# EAGLE design Motor Quad Board (EAGLE 8.7.0)
CNAME: Franks FlightSim Boards; CPROJECT: Franks FlightSim Boards; CREVISION: v0.1; DESIGNER: Frank van Ierland
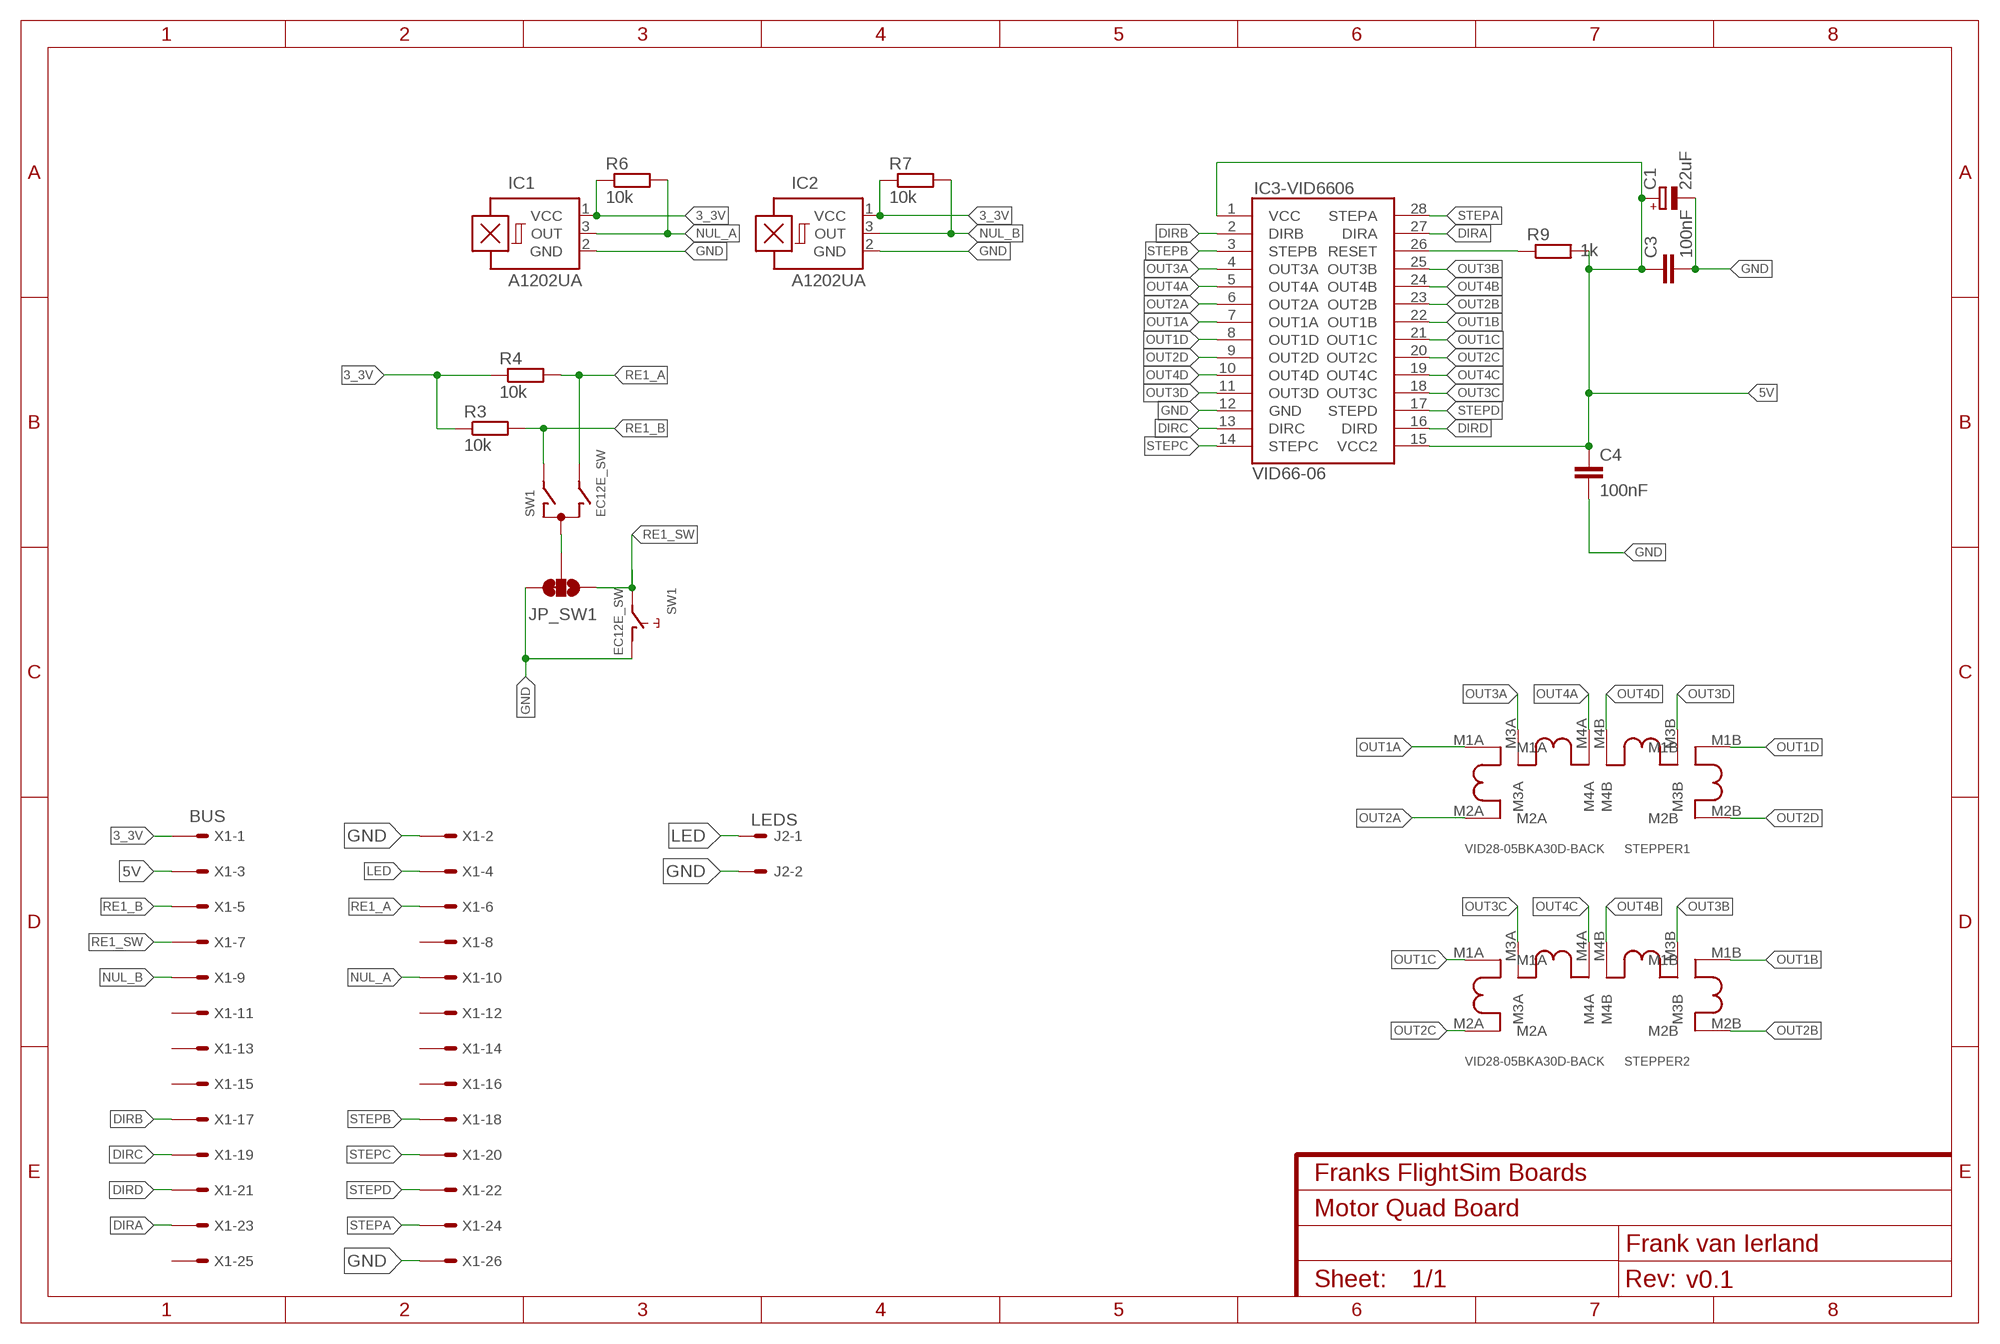
[diagram p0: schematic, sheet 1]

## Parts
C1  22uF  CPOL-EU153CLV-0505  [153CLV-0505]
C3  100nF  C-EUC0805  [C0805]
C4  100nF  C-EUC0805  [C0805]
IC1  A1202UA  [SIP3-UA]
IC2  A1202UA  [SIP3-UA]
IC3-VID6606  VID66-06  [SO28W]
J2  LEDS  22-27-2021-02  [6410-02]
JP_SW1  JUMPER-SMT_3_1-NC_TRACE_SILK  [SMT-JUMPER_3_1-NC_TRACE_SILK]
R3  10k  R-EU_M1206  [M1206]
R4  10k  R-EU_M1206  [M1206]
R6  10k  R-EU_M1206  [M1206]
R7  10k  R-EU_M1206  [M1206]
R9  1k  R-EU_M1206  [M1206]
STEPPER1  VID28-05BKA30D-BACK  [BKA30D-R5-BACKMOUNT]
STEPPER2  VID28-05BKA30D-BACK  [BKA30D-R5-BACKMOUNT]
SW1  EC12E_SW  [ALPS_EC12E_SW]
X1  BUS  057-026-1  [057-026-1]

## Nets
3_3V [3_3V]: IC1.1(VCC) IC2.1(VCC) R3.1 R4.1 R6.1 R7.1 X1.1
5V [5V]: C1.+ C3.1 C4.1 IC3-VID6606.1(VCC) IC3-VID6606.15(VCC2) R9.2 X1.3
DIRA: IC3-VID6606.27(DIRA) X1.23
DIRB: IC3-VID6606.2(DIRB) X1.17
DIRC: IC3-VID6606.13(DIRC) X1.19
DIRD: IC3-VID6606.16(DIRD) X1.21
GND [GND]: C1.- C3.2 C4.2 IC1.2(GND) IC2.2(GND) IC3-VID6606.12(GND) J2.2 JP_SW1.3 SW1.D X1.2 X1.26
LED [LED]: J2.1 X1.4
N$8: JP_SW1.2 SW1.C
N$15: IC3-VID6606.26(RESET) R9.1
NUL_A: IC1.3(OUT) R6.2 X1.10
NUL_B: IC2.3(OUT) R7.2 X1.9
OUT1A: IC3-VID6606.7(OUT1A) STEPPER1.M1A
OUT1B: IC3-VID6606.22(OUT1B) STEPPER2.M1B
OUT1C: IC3-VID6606.21(OUT1C) STEPPER2.M1A
OUT1D: IC3-VID6606.8(OUT1D) STEPPER1.M1B
OUT2A: IC3-VID6606.6(OUT2A) STEPPER1.M2A
OUT2B: IC3-VID6606.23(OUT2B) STEPPER2.M2B
OUT2C: IC3-VID6606.20(OUT2C) STEPPER2.M2A
OUT2D: IC3-VID6606.9(OUT2D) STEPPER1.M2B
OUT3A: IC3-VID6606.4(OUT3A) STEPPER1.M3A
OUT3B: IC3-VID6606.25(OUT3B) STEPPER2.M3B
OUT3C: IC3-VID6606.18(OUT3C) STEPPER2.M3A
OUT3D: IC3-VID6606.11(OUT3D) STEPPER1.M3B
OUT4A: IC3-VID6606.5(OUT4A) STEPPER1.M4A
OUT4B: IC3-VID6606.24(OUT4B) STEPPER2.M4B
OUT4C: IC3-VID6606.19(OUT4C) STEPPER2.M4A
OUT4D: IC3-VID6606.10(OUT4D) STEPPER1.M4B
RE1_A: R4.2 SW1.B X1.6
RE1_B: R3.2 SW1.A X1.5
RE1_SW: JP_SW1.1 SW1.E X1.7
STEPA: IC3-VID6606.28(STEPA) X1.24
STEPB: IC3-VID6606.3(STEPB) X1.18
STEPC: IC3-VID6606.14(STEPC) X1.20
STEPD: IC3-VID6606.17(STEPD) X1.22
Unconnected: SW1.GND1(G) SW1.GND2(G) X1.8 X1.11 X1.12 X1.13 X1.14 X1.15 X1.16 X1.25

## Library data of the parts
C1 = resistor:CPOL-EU: POLARIZED CAPACITOR, European symbol
C3 C4 = rcl:C-EU: CAPACITOR, European symbol; SPICEPREFIX: C
IC1 IC2 = allegro:A12*?: Hall-effect bipolar switch Source: http://www.allegromicro.com/en/Products/Part_Numbers/1202/1202.pdf; OC_FARNELL: unknown; OC_NEWARK: unknown
IC3-VID6606 = Franks:VID66-06: GENERAL DESCRIPTION The quad stepping motor driver VID66-06 is a monolithic CMOS device intended to be used as an interface circuit to ease the use of the stepper motor VID29-XX. It is specifically designed for applications in the car dashboard. The chip allows the user to drive four motors as it contains four identical drivers on the same chip. The driver circuit converts a pulse train f(scx) into a current level sequence sent to the motor coils. This sequence is used to produce the micro stepping movement of the motor. Each inner driver in the chip generates 2 sequent logic pulse signals and provides shaft stepping angle resolution 1/12°. FEATURES -Generates micro steps -Glitch filters on all inputs -VDD = 4.5 to 5.5V -Low EMI emission Link to pdf <http://www.vid.wellgain.com/UploadFile/down/2009111391612_VID6606%20manual%20060927.pdf>
J2 = con-molex:22-?-02: CONNECTOR wire to board 2.54 mm (.1 inch) pitch header; MF: MOLEX; OC_FARNELL: unknown; OC_NEWARK: unknown
JP_SW1 = SparkFun-Jumpers:JUMPER-SMT_3_1-NC_TRACE: Normally closed trace jumper (1 of 2 connections) This jumper has a trace between two pads so it's normally closed (NC). The other connection is normally open (NO). Use a razor knife to open the connection. For best results follow the IPC guidelines for cutting traces: Cutout at least 0.063 mm (0.005 in). Remove all loose material to clean up the cut area. Seal the cut with an approved epoxy. Reapply solder to reclose the connection, or to close the NO connection.
R3 R4 R6 R7 R9 = resistor:R-EU_: RESISTOR, European symbol
STEPPER1 STEPPER2 = Franks:VID28-05
SW1 = switch-alps:EC12E_SW: ALPS rotary Encoder EC12E series with switch; MPN: EC12E2424407; OC_FARNELL: 1520813; OC_NEWARK: 74M1068
X1 = con-panduit:057-026-: CONNECTOR 20-pin series 057 contact pc board low profile headers; OC_FARNELL: unknown; OC_NEWARK: unknown

## Net classes
1 GND: width 0.762 mm
2 VCC: width 0.635 mm
3 LED: width 0.508 mm
4 5V: width 0.508 mm
5 3_3V: width 0.508 mm

## Board
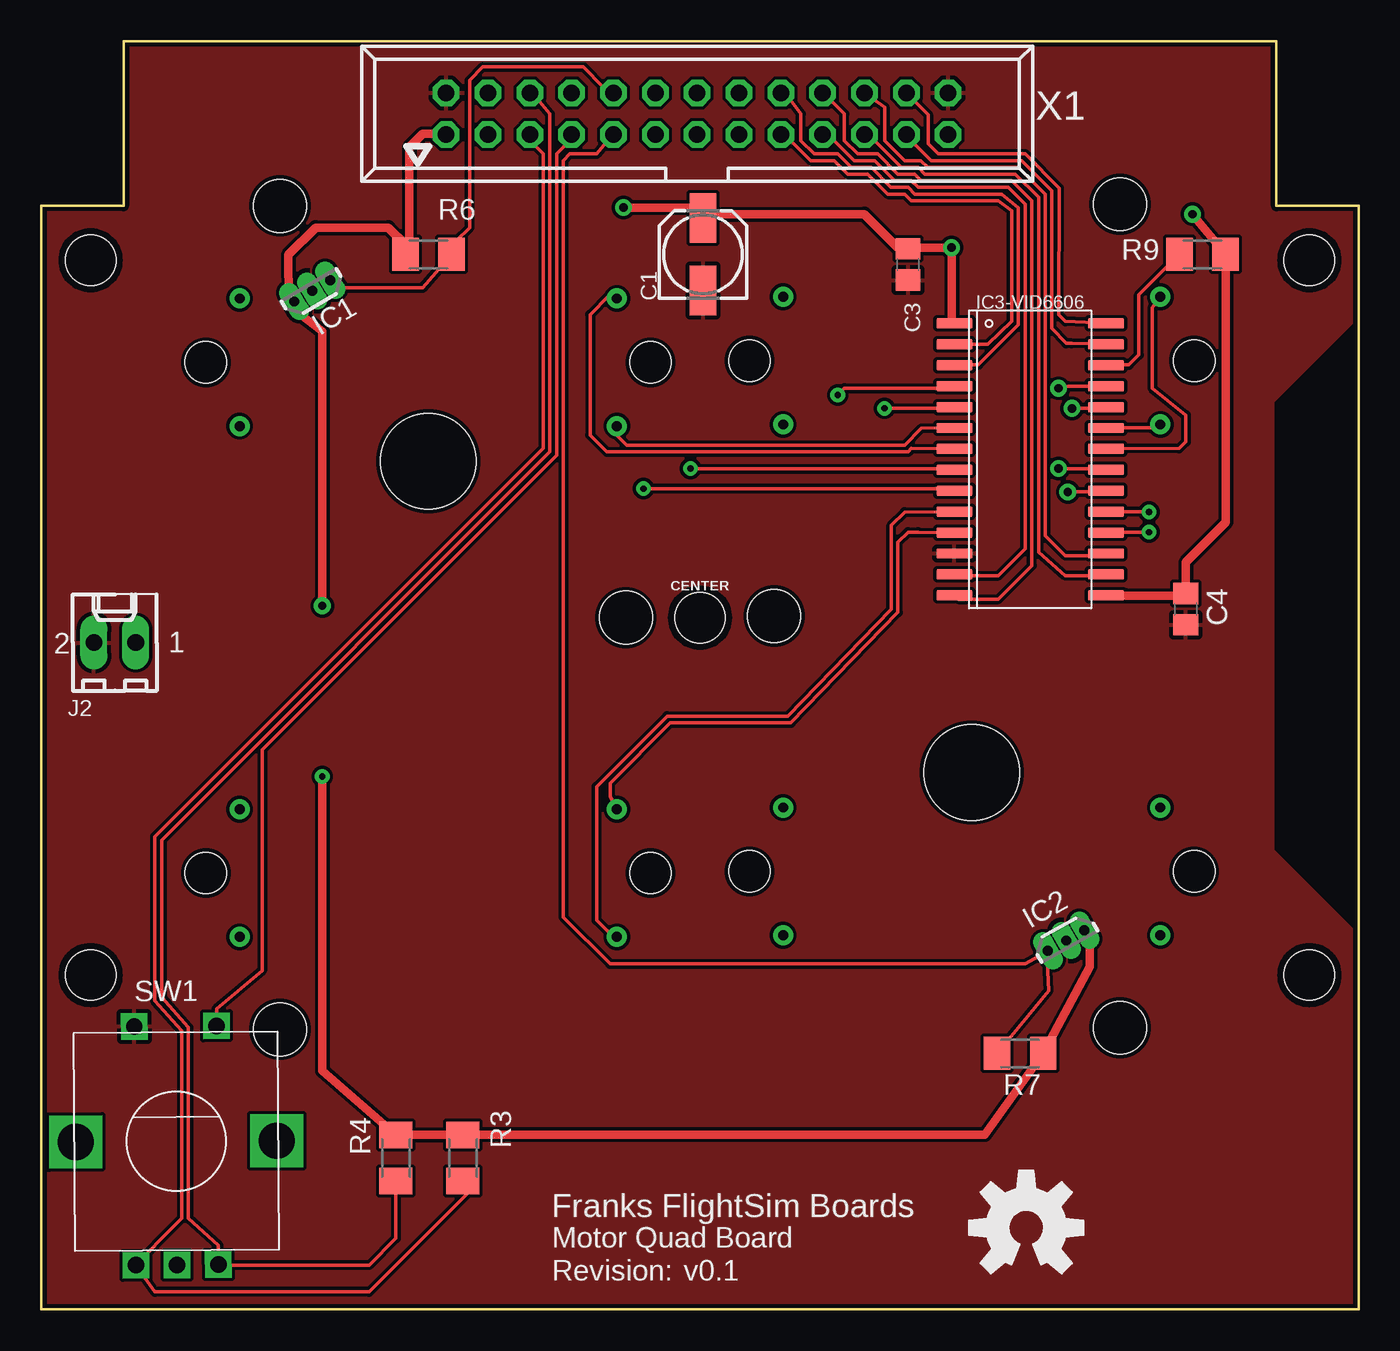
[diagram p1: board, top side]
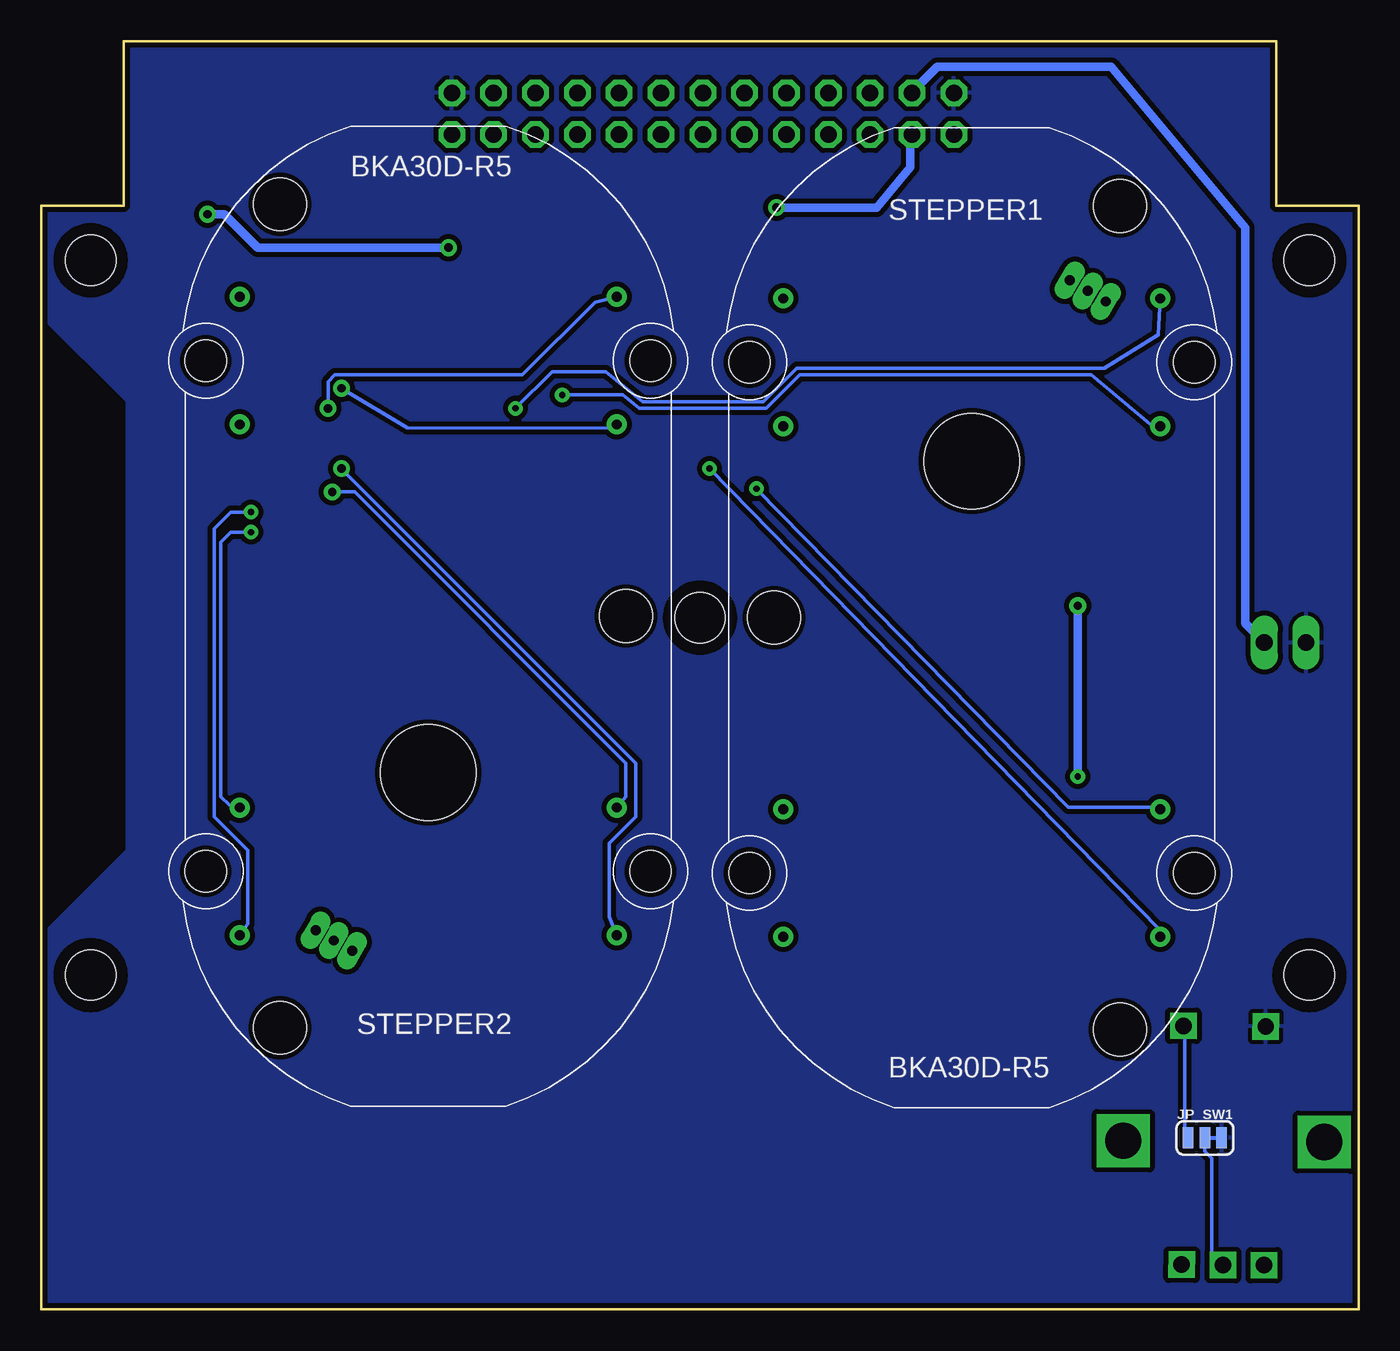
[diagram p2: board, bottom side, seen from below]

Size 80 x 77 mm. Coordinates in mm from the lower left corner, seen from the top.
Outline: 0,0 80,0 80,67 75,67 75,77 5,77 5,67 0,67 0,0
Copper layers (1*16): Top 0.035mm / dielectric 1.5mm / Bottom 0.035mm
Design rules "SparkFun *": minimum track width 8mil, minimum drill 15mil, track to track 8mil, track to pad 8mil, pad to pad 8mil, via to via 8mil, smd to smd 8mil, copper to edge 10mil, drill to drill 8mil, minimum pad ring 12mil, minimum via ring 10mil, stop-mask expansion 4mil, vias tented up to drill 25mil, thermal gap 10mil

### Footprints (pad centres in the part's own frame; a part is rotated, then mirrored left to right if it is on the bottom)
153CLV-0505 = smd 3 x 1.6: + 2.2,0; - -2.2,0
C0805 = smd 1.3 x 1.5: 1 -0.95,0; 2 0.95,0
STAND-OFF-TIGHT = hole 3.048: 0,0
SIP3-UA = drill 0.6 pad 0.7 long: 1 -1.27,0; 2 0,0; 3 1.27,0
SO28W = smd 2.2 x 0.6: 1 -4.6,8.255; 2 -4.6,6.985; 3 -4.6,5.715; 4 -4.6,4.445; 5 -4.6,3.175; 6 -4.6,1.905; 7 -4.6,0.635; 8 -4.6,-0.635; 9 -4.6,-1.905; 10 -4.6,-3.175; 11 -4.6,-4.445; 12 -4.6,-5.715; 13 -4.6,-6.985; 14 -4.6,-8.255; 15 4.6,-8.255; 16 4.6,-6.985; 17 4.6,-5.715; 18 4.6,-4.445; 19 4.6,-3.175; 20 4.6,-1.905; 21 4.6,-0.635; 22 4.6,0.635; 23 4.6,1.905; 24 4.6,3.175; 25 4.6,4.445; 26 4.6,5.715; 27 4.6,6.985; 28 4.6,8.255
6410-02 = drill 1.016 long: 1 1.27,0; 2 -1.27,0
SMT-JUMPER_3_1-NC_TRACE_SILK = smd 0.635 x 1.27: 1 -1.016,0; 2 0,0; 3 1.016,0
M1206 = smd 1.6 x 2: 1 -1.4,0; 2 1.4,0
BKA30D-R5-BACKMOUNT = drill 0.6 pad 0.8: M1A -11.45,9.88; M1B 11.45,-28.88; M2A -11.45,2.13; M2B 11.45,-21.13; M3A 11.45,2.13; M3B -11.45,-21.13; M4A 11.45,9.88; M4B -11.45,-28.88 | hole 2.5: 13.5,6; 13.5,-25; -13.5,-25; -13.5,6 | hole 5.8: 0,0 | hole 3.2: 9,-34.5; 9,15.5; -12,-9.5
ALPS_EC12E_SW = drill 1 square: A -2.5,-7.5; B 2.5,-7.5; C 0,-7.5; D -2.5,7; E 2.5,7 | drill 2.2 square: GND1 -6.1,0; GND2 6.1,0
057-026-1 = drill 1 octagon: 1 -15.24,-1.27; 2 -15.24,1.27; 3 -12.7,-1.27; 4 -12.7,1.27; 5 -10.16,-1.27; 6 -10.16,1.27; 7 -7.62,-1.27; 8 -7.62,1.27; 9 -5.08,-1.27; 10 -5.08,1.27; 11 -2.54,-1.27; 12 -2.54,1.27; 13 0,-1.27; 14 0,1.27; 15 2.54,-1.27; 16 2.54,1.27; 17 5.08,-1.27; 18 5.08,1.27; 19 7.62,-1.27; 20 7.62,1.27; 21 10.16,-1.27; 22 10.16,1.27; 23 12.7,-1.27; 24 12.7,1.27; 25 15.24,-1.27; 26 15.24,1.27

### Placement (x,y rotation side)
C1  40.18,64.06 90 top
C3  52.63,63.45 270 top
C4  69.49,42.52 270 top
CENTER  [STAND-OFF-TIGHT]  40,42 0 top
IC1  16.46,61.84 30.5 top
IC2  62.23,22.4 209.4 top
IC3-VID6606  60.05,51.61 0 top
J2  4.47,40.48 0 top
JP_SW1  9.35,10.41 0 bottom
R3  25.6,9.19 270 top
R4  21.54,9.19 270 top
R6  23.52,64.06 0 top
R7  59.44,15.54 180 top
R9  70.51,64.06 0 top
STEPPER1  23.5,51.5 0 bottom
STEPPER2  56.5,32.6 180 bottom
SW1  8.2,10.2 0.4 top
U$1  [STAND-OFF-TIGHT]  3,20.3 0 top
U$9  [OSHW-LOGO-L]  59.81,4.96 0 top
U$12  [STAND-OFF-TIGHT]  3,63.7 0 top
U$13  [STAND-OFF-TIGHT]  77,63.7 0 top
U$15  [STAND-OFF-TIGHT]  77,20.3 0 top
X1  39.83,72.59 0 top

### Tracks (layer width: path | path; a pad name or v marks a point on that pad's centre or on a via)
3_3V  (via drill 0.38, 0.51)
  Top 0.508: 22.12,64.64 22.35,64.87 22.35,70.56 23.16,71.37 23.98,71.37 X1.1 | 22.12,64.64 R6.1 | v17.07,32.36 17.07,14.48 R4.1 R3.1 35.36,10.61 57.3,10.61 R7.1 63.67,20.81 63.67,22.27 63.34,22.6 IC2.1 | v17.07,42.72 17.07,59.38 15.37,60.68 IC1.1 15.04,62.02 15.01,63.22 15.01,64.03 16.66,65.68 21.08,65.68 22.12,64.64
  Bottom 0.508: v17.07,42.72 v17.07,32.36
5V  (via drill 0.51)
  Top 0.508: IC3-VID6606.1 55.27,59.99 v55.27,64.46 52.83,64.46 C3.1 52.02,64.46 49.99,66.49 41.05,66.49 C1.+ 39.83,66.9 v35.36,66.9 | v69.9,66.49 R9.2 71.93,63.24 71.93,47.8 69.49,45.36 C4.1 arc-90 69.36,43.33 65.84,43.33 IC3-VID6606.15
  Bottom 0.508: v35.36,66.9 29.26,66.9 27.23,69.34 27.23,70.56 X1.3 | v69.9,66.49 68.89,66.49 66.85,64.46 v55.27,64.46
DIRA
  Top 0.203: IC3-VID6606.27 62.56,58.65 62.23,58.65 61.37,59.59 61.37,67.92 59.54,69.75 54.05,69.75 52.83,70.97 52.83,71.02 X1.23
DIRB
  Top 0.203: IC3-VID6606.2 57.48,58.59 58.93,59.99 58.93,66.7 58.12,67.31 52.83,67.31 52.43,67.71 51.41,67.71 50.19,68.93 48.97,68.93 48.16,69.75 46.74,69.75 45.52,70.97 X1.17
DIRC
  Top 0.203: IC3-VID6606.13 54.46,44.55 58.12,44.55 59.74,46.17 59.74,67.1 58.73,68.12 53.24,68.12 52.83,68.53 51.82,68.53 50.6,69.75 49.38,69.75 48.16,70.97 X1.19
DIRD
  Top 0.203: IC3-VID6606.16 64.21,44.55 62.18,44.55 60.55,45.97 60.55,67.51 59.13,68.93 53.65,68.93 53.24,69.34 52.22,69.34 50.6,70.97 50.6,71.17 X1.21
GND
  pour Bottom (isolate 0.305): 5,77 5,67 0,67 0,0 80,0 80.06,22.6 74.78,27.89 74.78,55.15 80.06,60.4 80,67 75,67 75,77
  pour Top: 0,67 0,0 80,0 80,22.66 74.78,27.89 74.78,55.12 80.06,60.4 80,67 75,67 74.93,77.01 5.08,77 5,67
LED
  Bottom 0.508: J2.1 6.91,41.65 6.91,65.68 15.04,75.44 25.6,75.44 27.18,73.86 X1.4
N$8
  Bottom 0.203: JP_SW1.2 9.35,9.6 8.94,9.19 8.94,3.1 SW1.C
N$15
  Top 0.203: IC3-VID6606.26 65.43,57.35 66.04,57.35 66.65,57.96 66.65,61.59 R9.1
NUL_A
  Top 0.203: IC1.3 18.29,62.02 23.16,62.02 R6.2 25.2,64.87 26.01,65.68 26.01,74.62 26.82,75.44 32.92,75.44 34.14,74.22 X1.10
NUL_B
  Top 0.203: 61.05,21.7 59.74,20.98 34.54,20.98 31.7,23.82 31.7,69.75 32.11,70.15 33.73,70.15 34.46,71.05 34.46,71.04 X1.9 | 61.05,21.7 IC2.3 | R7.2 61.16,19.35 61.05,21.7
OUT1A
  Top 0.203: IC3-VID6606.7 52.83,52.27 52.63,52.07 34.34,52.07 33.33,53.08 33.33,60.4 34.47,61.54 STEPPER1.M1A
OUT1B
  Top 0.203: IC3-VID6606.22 69.09,52.27 69.49,52.68 69.49,54.3 67.46,55.93 67.46,60.8 STEPPER2.M1B
OUT1C  (via drill 0.51)
  Top 0.203: v61.77,51.05 63.8,51.05 63.88,50.98 IC3-VID6606.21
  Bottom 0.203: v61.77,51.05 43.89,33.17 43.89,29.92 45.52,28.29 45.52,23.85 STEPPER2.M1A
OUT1D  (via drill 0.38)
  Top 0.203: v39.42,51.05 54.86,51.05 54.94,50.98 IC3-VID6606.8
  Bottom 0.203: v39.42,51.05 12.12,23.09 STEPPER1.M1B
OUT2A
  Top 0.203: IC3-VID6606.6 53.44,53.49 52.43,52.47 35.56,52.47 34.95,53.08 STEPPER1.M2A
OUT2B
  Top 0.203: IC3-VID6606.23 67.36,53.52 STEPPER2.M2B
OUT2C  (via drill 0.51)
  Top 0.203: v62.33,49.63 64.41,49.63 IC3-VID6606.20
  Bottom 0.203: v62.33,49.63 60.96,49.63 44.5,33.17 44.5,31.14 44.91,30.66 STEPPER2.M2A
OUT2D  (via drill 0.38)
  Top 0.203: IC3-VID6606.9 54.53,49.7 54.46,49.83 v36.58,49.83
  Bottom 0.203: v36.58,49.83 17.65,30.5 12.3,30.5 STEPPER1.M2B
OUT3A  (via drill 0.38)
  Top 0.203: v48.36,55.52 48.77,55.93 54.66,55.93 IC3-VID6606.4
  Bottom 0.203: v48.36,55.52 44.7,55.52 43.69,54.71 35.97,54.71 33.93,56.74 16.26,56.74 12.65,53.74 STEPPER1.M3A
OUT3B  (via drill 0.51)
  Top 0.203: IC3-VID6606.25 62.36,56.05 v61.77,55.93
  Bottom 0.203: v61.77,55.93 57.78,53.52 45.52,53.49 STEPPER2.M3B
OUT3C  (via drill 0.38)
  Top 0.203: IC3-VID6606.18 65.43,47.19 v67.26,47.19
  Bottom 0.203: v67.26,47.19 68.48,47.19 69.09,46.58 69.09,31.14 68.58,30.66 STEPPER2.M3A
OUT3D
  Top 0.203: IC3-VID6606.11 53.24,47.19 52.63,47.19 52.02,46.58 52.02,42.31 45.52,35.61 38.2,35.61 34.54,31.95 34.54,31.14 STEPPER1.M3B
OUT4A  (via drill 0.38)
  Top 0.203: v51.21,54.71 54.86,54.71 | 55.27,54.71 54.86,54.71 | 54.86,54.71 55.19,54.78 IC3-VID6606.5
  Bottom 0.203: v51.21,54.71 48.97,56.94 45.72,56.94 43.48,55.12 36.17,55.12 34.14,57.15 15.44,57.15 12.19,59.18 STEPPER1.M4A
OUT4B  (via drill 0.51)
  Top 0.203: v62.59,54.71 63.8,54.71 IC3-VID6606.24
  Bottom 0.203: v62.59,54.71 62.59,56.33 62.18,56.74 50.8,56.74 46.35,61.14 STEPPER2.M4B
OUT4C  (via drill 0.38)
  Top 0.203: v67.26,48.41 67.06,48.41 67.03,48.44 IC3-VID6606.19
  Bottom 0.203: v67.26,48.41 68.48,48.41 69.49,47.39 69.49,29.92 67.46,27.89 67.46,23.42 STEPPER2.M4A
OUT4D
  Top 0.203: IC3-VID6606.10 52.43,48.41 51.61,47.6 51.61,42.52 45.31,36.01 38,36.01 33.73,31.75 33.73,23.62 34.54,22.81 STEPPER1.M4B
RE1_A
  Top 0.203: R4.2 21.54,4.32 19.91,2.69 11.38,2.69 SW1.B 10.75,3.89 8.94,5.53 8.94,17.12 7.32,18.95 7.32,28.5 30.89,52.07 30.89,72.59 29.83,73.86 X1.6
RE1_B
  Top 0.203: R3.2 26.01,7.16 19.91,1.06 6.91,1.06 SW1.A 7.32,4.32 8.53,5.53 8.53,16.91 6.91,18.74 6.91,28.7 30.48,52.27 30.48,70.15 29.67,70.97 X1.5
RE1_SW
  Top 0.203: SW1.E 10.65,18.25 13.41,20.57 13.41,33.98 31.29,51.86 31.29,70.15 32.11,70.97 X1.7
  Bottom 0.203: JP_SW1.1 10.57,10.82 10.57,16.51 SW1.E
STEPA
  Top 0.203: IC3-VID6606.28 62.18,59.99 61.77,60.4 61.8,68.08 59.74,70.15 54.46,70.15 53.85,70.76 53.85,72.54 X1.24
STEPB
  Top 0.203: IC3-VID6606.3 55.27,57.35 56.9,57.35 59.33,59.79 59.33,66.9 58.32,67.71 53.03,67.71 52.63,68.12 51.58,68.12 50.39,69.34 49.17,69.34 48.36,70.15 46.94,70.15 46.13,70.97 46.13,72.59 45.52,73.4 X1.18
STEPC
  Top 0.203: IC3-VID6606.14 55.68,43.13 58.12,43.13 60.15,45.16 60.15,67.31 58.93,68.53 53.44,68.53 53.03,68.93 52.02,68.93 50.8,70.15 49.58,70.15 48.77,70.97 48.77,72.59 47.5,73.86 X1.20
STEPD
  Top 0.203: IC3-VID6606.17 63.68,45.9 63.8,45.77 62.18,45.77 60.96,46.99 60.96,67.71 59.33,69.34 53.81,69.34 53.41,69.75 52.43,69.75 51.21,70.97 51.21,73 X1.22

### Text on the board
tNames: Revision: